# Altium schematic sheet Master.SchDoc: SASIパリティ基板
size A4; Author: T.S; Address1: 回路図; Address2: 17.11.06; Revision: 0; SheetNumber: 1; SheetTotal: 1
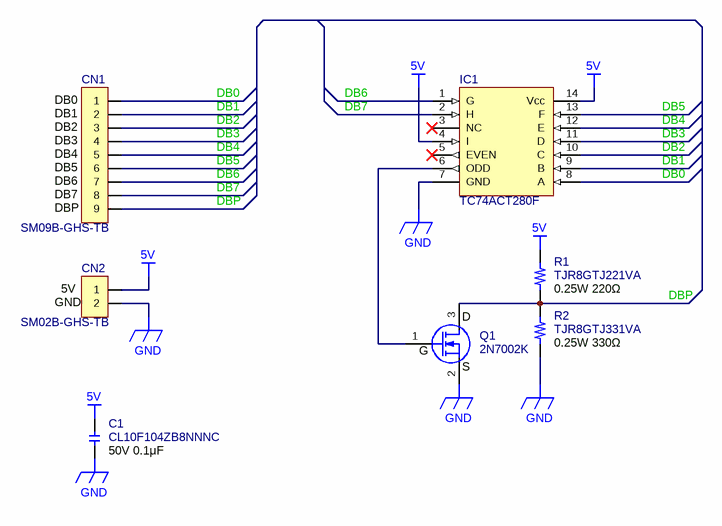
[diagram p0: Master.SchDoc]

## Parts
C1  CL10F104ZB8NNNC  [R1608]
CN1  SM09B-GHS-TB  [CN_SM09B-GHS-TB]
CN2  SM02B-GHS-TB  [CN_SM02B-GHS-TB]
IC1  TC74ACT280F  [SOP14-P-300-1.27A]
Q1  2N7002K  [SOT-23]
R1  TJR8GTJ221VA  [R3216]
R2  TJR8GTJ331VA  [R3216]

## Nets
5V: C1.1 CN2.1 IC1.4(I) IC1.14(Vcc) R1.1
GND: C1.2 CN2.2 IC1.7(GND) Q1.2(S) R2.2
DB0: CN1.1 IC1.8(A)
DB1: CN1.2 IC1.9(B)
DB2: CN1.3 IC1.10(C)
DB3: CN1.4 IC1.11(D)
DB4: CN1.5 IC1.12(E)
DB5: CN1.6 IC1.13(F)
DB6: CN1.7 IC1.1(G)
DB7: CN1.8 IC1.2(H)
DBP: CN1.9 Q1.3(D) R1.2 R2.1
NetIC1_6: IC1.6(ODD) Q1.1(G)

Not connected (* = marked no-connect by the designer): IC1 3(NC)* 5(EVEN)*

## Notes on the sheet
- (near CN1) DB0
- (near CN1) DB1
- (near CN1) DB2
- (near CN1) DB3
- (near CN1) DB4
- (near CN1) DB5
- (near CN1) DB6
- (near CN1) DB7
- (near CN1) DBP
- (near CN2) GND
- (near CN2) 5V
- (near R1) 0.25W 220Ω
- (near R2) 0.25W 330Ω
- (near C1) 50V 0.1μF
- Title
- Approved by
- Checked by
- Drawn by
- Number
- File:
- Sheet
- Rev.
- Date
- Contents
- Rev.by
- Apr.by
- Size:
- A4
- Form:
- of

## Library data of the parts
C1 = CL10F104ZB8NNNC: ﾁｯﾌﾟ形積層ｾﾗﾐｯｸｺﾝﾃﾞﾝｻ_50V/0.1μF; Text Field1: 三星電機; Text Field3: ?個/ﾘｰﾙ; Text Field4: 立山科学工業㈱; Text Field2: ﾁｯﾌﾟ形積層ｾﾗﾐｯｸｺﾝﾃﾞﾝｻ_50V/0.1μF; Distributor: 立山科学工業㈱; Maker: 三星電機; Name: ﾁｯﾌﾟ形積層ｾﾗﾐｯｸｺﾝﾃﾞﾝｻ_50V/0.1μF
CN1 = SM09B-GHS-TB: GHｺﾈｸﾀ9P ｻｲﾄﾞ型 ﾅﾁｭﾗﾙ; Maker: 日本圧着端子製造㈱; Name: GHｺﾈｸﾀ9P ｻｲﾄﾞ型 ﾅﾁｭﾗﾙ; Distributor: 有限会社アスク
CN2 = SM02B-GHS-TB: GHｺﾈｸﾀ2P ｻｲﾄﾞ型 ﾅﾁｭﾗﾙ; Maker: 日本圧着端子製造㈱; Name: GHｺﾈｸﾀ2P ｻｲﾄﾞ型 ﾅﾁｭﾗﾙ; Distributor: 有限会社アスク
IC1 = TC74ACT280F: 9-Bit Parity Generator/Checker; Maker: 東芝; Name: 9-Bit Parity Generator/Checker; Distributor: 名古屋理研電具㈱
Q1 = 2N7002K: ｼﾘｺﾝNﾁｬﾝﾈﾙ MOS FET 60V 0.3A; Maker: PANJIT; Distributor: 秋月電子通商; Name: ｼﾘｺﾝNﾁｬﾝﾈﾙ MOS FET 60V 0.3A
R1 = TJR8GTJ221VA: 角形厚膜ﾁｯﾌﾟ抵抗器 0.25W/220Ω; Maker: 立山科学工業㈱; Value: 220; Name: 角形厚膜ﾁｯﾌﾟ抵抗器 0.25W/220Ω; Distributor: 立山科学工業㈱
R2 = TJR8GTJ331VA: 角形厚膜ﾁｯﾌﾟ抵抗器 0.25W/330Ω; Maker: 立山科学工業㈱; Value: 330; Name: 角形厚膜ﾁｯﾌﾟ抵抗器 0.25W/330Ω; Distributor: 立山科学工業㈱